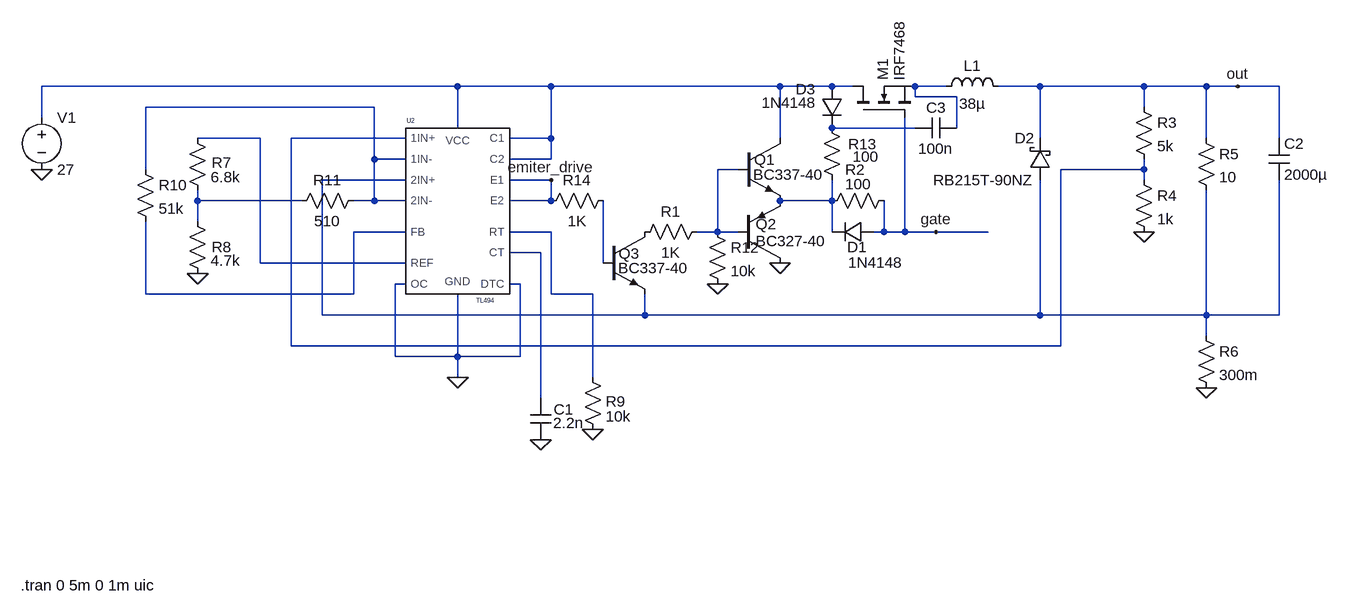
[diagram p0: schematic tl494_buck.asc]
tl494_buck.asc, the LTspice schematic file:
Version 4
SHEET 1 1556 768
WIRE 208 -16 -432 -16
WIRE 352 -16 208 -16
WIRE 704 -16 352 -16
WIRE 784 -16 704 -16
WIRE 816 -16 784 -16
WIRE 912 -16 896 -16
WIRE 960 -16 912 -16
WIRE 1104 -16 1040 -16
WIRE 1264 -16 1104 -16
WIRE 1360 -16 1264 -16
WIRE 1408 -16 1360 -16
WIRE 1472 -16 1408 -16
WIRE 912 0 912 -16
WIRE 976 0 912 0
WIRE 80 16 -272 16
WIRE 1264 16 1264 -16
WIRE -432 32 -432 -16
WIRE 208 48 208 -16
WIRE 912 48 784 48
WIRE 976 48 976 0
WIRE -96 64 -192 64
WIRE 128 64 -48 64
WIRE 352 64 352 -16
WIRE 352 64 288 64
WIRE 704 64 704 -16
WIRE 1104 64 1104 -16
WIRE 1360 64 1360 -16
WIRE 1472 64 1472 -16
WIRE 80 96 80 16
WIRE 128 96 80 96
WIRE 352 96 352 64
WIRE 352 96 288 96
WIRE -272 112 -272 16
WIRE 640 112 608 112
WIRE 1264 112 1264 96
WIRE 1264 112 1136 112
WIRE 128 128 0 128
WIRE 352 128 288 128
WIRE 1264 128 1264 112
WIRE -192 160 -192 144
WIRE -32 160 -192 160
WIRE 80 160 80 96
WIRE 80 160 48 160
WIRE 128 160 80 160
WIRE 352 160 352 128
WIRE 352 160 288 160
WIRE 784 160 784 128
WIRE 784 160 704 160
WIRE -192 192 -192 160
WIRE 128 208 48 208
WIRE 352 208 288 208
WIRE 608 208 608 112
WIRE 608 208 576 208
WIRE 640 208 608 208
WIRE 784 208 784 160
WIRE 864 208 864 160
WIRE 864 208 848 208
WIRE 896 208 896 32
WIRE 896 208 864 208
WIRE 944 208 896 208
WIRE 1024 208 944 208
WIRE 336 240 288 240
WIRE -96 256 -96 64
WIRE 128 256 -96 256
WIRE 432 256 432 160
WIRE 128 288 112 288
WIRE 304 288 288 288
WIRE -272 304 -272 192
WIRE 48 304 48 208
WIRE 48 304 -272 304
WIRE 352 304 352 208
WIRE 416 304 352 304
WIRE 0 336 0 128
WIRE 496 336 496 304
WIRE 496 336 0 336
WIRE 1104 336 1104 128
WIRE 1104 336 496 336
WIRE 1360 336 1360 144
WIRE 1360 336 1104 336
WIRE 1472 336 1472 128
WIRE 1472 336 1360 336
WIRE 1360 368 1360 336
WIRE -48 384 -48 64
WIRE 1136 384 1136 112
WIRE 1136 384 -48 384
WIRE 112 400 112 288
WIRE 208 400 208 304
WIRE 208 400 112 400
WIRE 304 400 304 288
WIRE 304 400 208 400
WIRE 208 432 208 400
WIRE 416 432 416 304
WIRE 336 464 336 240
FLAG 704 256 0
FLAG 1264 208 0
FLAG 1360 448 0
FLAG -432 112 0
FLAG -192 272 0
FLAG 416 512 0
FLAG 336 528 0
FLAG 208 432 0
FLAG 1408 -16 out
FLAG 352 128 emiter_drive
FLAG 944 208 gate
FLAG 608 288 0
SYMBOL nmos 816 32 R270
WINDOW 0 57 46 Left 2
SYMATTR InstName M1
SYMATTR Value IRF7468
SYMBOL npn 640 64 R0
WINDOW 0 24 33 Left 2
WINDOW 3 23 56 Left 2
SYMATTR InstName Q1
SYMATTR Value BC337-40
SYMBOL pnp 640 256 M180
WINDOW 0 27 60 Left 2
WINDOW 3 27 34 Left 2
SYMATTR InstName Q2
SYMATTR Value BC327-40
SYMBOL res 592 192 R90
WINDOW 0 0 56 VBottom 2
WINDOW 3 32 56 VTop 2
SYMATTR InstName R1
SYMATTR Value 1K
SYMATTR SpiceLine tol=1 pwr=0.1
SYMBOL res 880 144 R90
WINDOW 0 -16 60 VBottom 2
WINDOW 3 -25 55 VTop 2
SYMATTR InstName R2
SYMATTR Value 100
SYMATTR SpiceLine tol=1 pwr=0.1
SYMBOL diode 848 192 R90
WINDOW 0 55 25 VBottom 2
WINDOW 3 48 -3 VTop 2
SYMATTR InstName D1
SYMATTR Value 1N4148
SYMBOL ind 944 0 R270
WINDOW 0 32 56 VTop 2
WINDOW 3 5 56 VBottom 2
SYMATTR InstName L1
SYMATTR Value 38µ
SYMBOL schottky 1120 128 R180
WINDOW 0 24 64 Left 2
WINDOW 3 24 0 Left 2
SYMATTR InstName D2
SYMATTR Value RB215T-90NZ
SYMATTR Description Diode
SYMATTR Type diode
SYMBOL res 1248 0 R0
SYMATTR InstName R3
SYMATTR Value 5k
SYMBOL res 1248 112 R0
SYMATTR InstName R4
SYMATTR Value 1k
SYMBOL res 1344 48 R0
SYMATTR InstName R5
SYMATTR Value 10
SYMBOL res 1344 352 R0
SYMATTR InstName R6
SYMATTR Value 300m
SYMBOL res -208 48 R0
WINDOW 0 38 53 Left 2
SYMATTR InstName R7
SYMATTR Value 6.8k
SYMBOL res -208 176 R0
WINDOW 0 38 55 Left 2
SYMATTR InstName R8
SYMATTR Value 4.7k
SYMBOL voltage -432 16 R0
WINDOW 123 0 0 Left 0
WINDOW 39 0 0 Left 0
SYMATTR InstName V1
SYMATTR Value 27
SYMBOL res 400 416 R0
WINDOW 0 36 53 Left 2
SYMATTR InstName R9
SYMATTR Value 10k
SYMBOL cap 320 464 R0
WINDOW 0 36 17 Left 2
WINDOW 3 35 38 Left 2
SYMATTR InstName C1
SYMATTR Value 2.2n
SYMBOL cap 1456 64 R0
SYMATTR InstName C2
SYMATTR Value 2000µ
SYMBOL res -288 96 R0
SYMATTR InstName R10
SYMATTR Value 51k
SYMBOL res 64 144 R90
WINDOW 0 0 56 VBottom 2
WINDOW 3 32 56 VTop 2
SYMATTR InstName R11
SYMATTR Value 510
SYMBOL res 592 192 R0
SYMATTR InstName R12
SYMATTR Value 10k
SYMBOL diode 768 -16 R0
WINDOW 0 -40 4 Left 2
WINDOW 3 -92 25 Left 2
SYMATTR InstName D3
SYMATTR Value 1N4148
SYMBOL res 768 32 R0
WINDOW 0 41 41 Left 2
WINDOW 3 48 60 Left 2
SYMATTR InstName R13
SYMATTR Value 100
SYMBOL cap 976 32 R90
WINDOW 0 0 32 VBottom 2
WINDOW 3 32 32 VTop 2
SYMATTR InstName C3
SYMATTR Value 100n
SYMBOL TL494 208 176 R0
SYMATTR InstName U2
SYMBOL npn 432 208 R0
WINDOW 0 24 33 Left 2
WINDOW 3 23 56 Left 2
SYMATTR InstName Q3
SYMATTR Value BC337-40
SYMBOL res 448 144 R90
WINDOW 0 0 56 VBottom 2
WINDOW 3 32 56 VTop 2
SYMATTR InstName R14
SYMATTR Value 1K
SYMATTR SpiceLine tol=1 pwr=0.1
TEXT -464 752 Left 2 !.tran 0 5m 0 1m uic

The netlist it stands for:
* tl494_buck.asc
M1 N001 gate N002 N002 IRF7468
Q1 N001 N007 N010 0 BC337-40
Q2 0 N007 N010 0 BC327-40
R1 N007 P001 1K tol=1 pwr=0.1
R2 gate N010 100 tol=1 pwr=0.1
D1 gate N010 1N4148
L1 N002 out 38µ
D2 N008 out RB215T-90NZ
R3 out N006 5k
R4 N006 0 1k
R5 out N008 10
R6 N008 0 300m
R7 N005 N009 6.8k
R8 N009 0 4.7k
V1 N001 0 27
R9 N012 0 10k
C1 N013 0 2.2n
C2 out N008 2000µ
R10 N003 N011 51k
R11 N003 N009 510
R12 N007 0 10k
D3 N001 N004 1N4148
R13 N004 N010 100
C3 N002 N004 100n
XU2 N006 N003 N011 0 N013 N012 0 N001 emiter_drive emiter_drive N001 N001 0 N005 N003 N008 TL494  ; pins 1IN+ 1IN- FB DTC CT RT GND C1 E1 E2 C2 VCC OC REF 2IN- 2IN+
Q3 P001 N014 N008 0 BC337-40
R14 N014 emiter_drive 1K tol=1 pwr=0.1
.model D D
.lib standard.dio
.model NPN NPN
.model PNP PNP
.lib standard.bjt
.model NMOS NMOS
.model PMOS PMOS
.lib standard.mos
.tran 0 5m 0 1m uic
.lib c:\Users\LPC-user\AppData\Local\LTspice\lib\sub\TL494.sub
.backanno
.end